# EAGLE design tm5 (EAGLE 9.6.1)
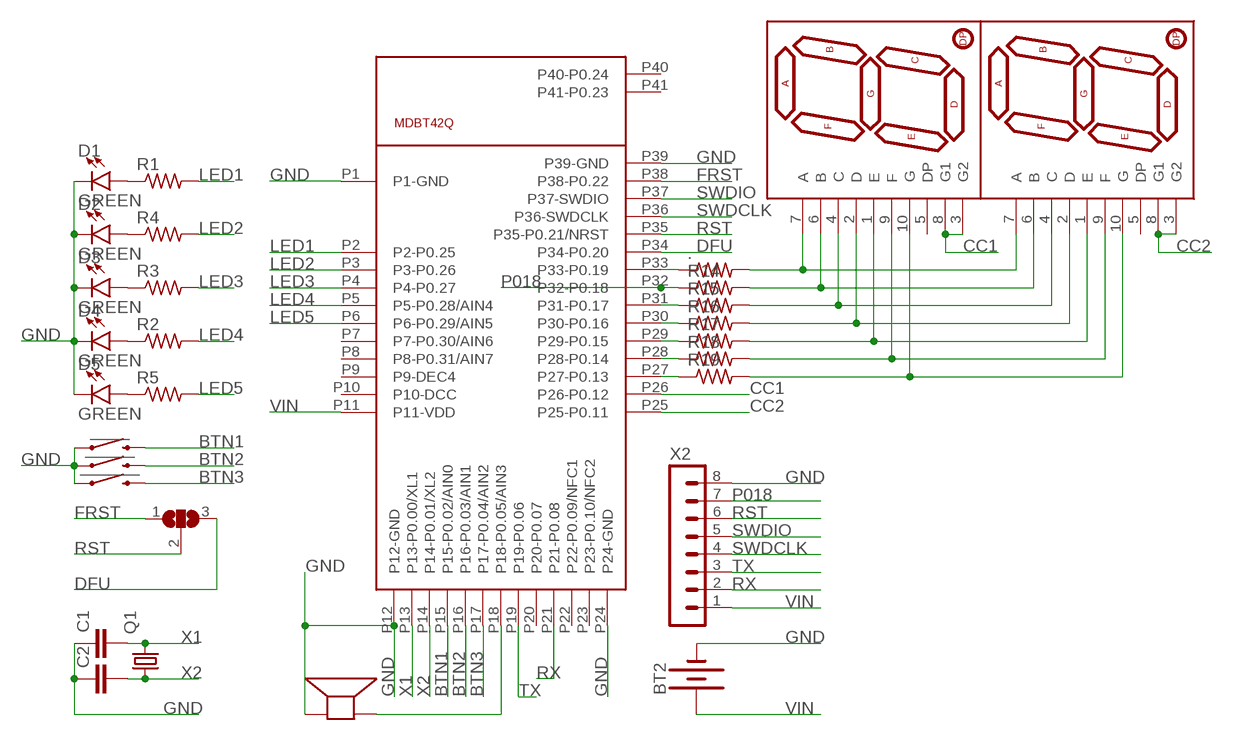
[diagram p0: schematic, sheet 1]

## Parts
.  R-US_R0603  [R0603]
____  MOMENTARY-SWITCH-SPST-SMD-6.2MM-TALL  [TACTILE_SWITCH_SMD_6.2MM_TALL]
_____  MOMENTARY-SWITCH-SPST-SMD-6.2MM-TALL  [TACTILE_SWITCH_SMD_6.2MM_TALL]
______  MOMENTARY-SWITCH-SPST-SMD-6.2MM-TALL  [TACTILE_SWITCH_SMD_6.2MM_TALL]
BT2  BATTERY-20MM_SMD_4LEGS_OVERPASTE  [BATTCON_20MM_4LEGS_OVERPASTE]
C1  C-EUC0603  [C0603]
C2  C-EUC0603  [C0603]
CFG  SJ2W  [SJ_2]
D1  GREEN  LED-GREEN1206  [LED-1206]
D2  GREEN  LED-GREEN1206  [LED-1206]
D3  GREEN  LED-GREEN1206  [LED-1206]
D4  GREEN  LED-GREEN1206  [LED-1206]
D5  GREEN  LED-GREEN1206  [LED-1206]
Q1  KX-327-NHT  [3.2X1.5]
R1  R-US_R0603  [R0603]
R2  R-US_R0603  [R0603]
R3  R-US_R0603  [R0603]
R4  R-US_R0603  [R0603]
R5  R-US_R0603  [R0603]
R14  R-US_R0603  [R0603]
R15  R-US_R0603  [R0603]
R16  R-US_R0603  [R0603]
R17  R-US_R0603  [R0603]
R18  R-US_R0603  [R0603]
R19  R-US_R0603  [R0603]
SPK1  SMT-0540-S-R  [SMT-0540-S-R]
U$1  MDBT42Q  [MDBT40]
U$2  7-SEGMENT-DISPLAY-1"-RED  [7-SEGMENT-SMD]
U$3  7-SEGMENT-DISPLAY-1"-RED  [7-SEGMENT-SMD]
X2  SM08B-SRSS-TB  [SM08B-SRSS-TB]

## Nets
BTN1: ____.B2 U$1.P15(P15-P0.02/AIN0)
BTN2: _____.B2 U$1.P16(P16-P0.03/AIN1)
BTN3: ______.B2 U$1.P17(P17-P0.04/AIN2)
CC1: U$1.P26(P26-P0.12) U$2.3(G2) U$2.8(G1)
CC2: U$1.P25(P25-P0.11) U$3.3(G2) U$3.8(G1)
DFU: CFG.3 U$1.P34(P34-P0.20)
FRST: CFG.1 U$1.P38(P38-P0.22)
GND: ____.A2 _____.A2 ______.A2 BT2.2(-) C1.1 C2.1 D1.C D2.C D3.C D4.C D5.C SPK1.-(+) U$1.P1(P1-GND) U$1.P12(P12-GND) U$1.P24(P24-GND) U$1.P39(P39-GND) X2.8
LED1: R1.2 U$1.P2(P2-P0.25)
LED2: R4.2 U$1.P3(P3-P0.26)
LED3: R3.2 U$1.P4(P4-P0.27)
LED4: R2.2 U$1.P5(P5-P0.28/AIN4)
LED5: R5.2 U$1.P6(P6-P0.29/AIN5)
N$1: ..1 U$1.P33(P33-P0.19)
N$3: R15.1 U$1.P31(P31-P0.17)
N$4: D1.A R1.1
N$5: D2.A R4.1
N$6: D3.A R3.1
N$7: D4.A R2.1
N$8: R16.1 U$1.P30(P30-P0.16)
N$9: R17.1 U$1.P29(P29-P0.15)
N$10: R18.1 U$1.P28(P28-P0.14)
N$11: R19.1 U$1.P27(P27-P0.13)
N$12: ..2 U$2.7(A) U$3.7(A)
N$13: SPK1.+(-) U$1.P18(P18-P0.05/AIN3)
N$14: R14.2 U$2.6(B) U$3.6(B)
N$15: R15.2 U$2.4(C) U$3.4(C)
N$16: D5.A R5.1
N$17: R16.2 U$2.2(D) U$3.2(D)
N$18: R17.2 U$2.1(E) U$3.1(E)
N$19: R18.2 U$2.9(F) U$3.9(F)
N$20: R19.2 U$2.10(G) U$3.10(G)
P018: R14.1 U$1.P32(P32-P0.18) X2.7
RST: CFG.2 U$1.P35(P35-P0.21/NRST) X2.6
RX: U$1.P21(P21-P0.08) X2.2
SWDCLK: U$1.P36(P36-SWDCLK) X2.4
SWDIO: U$1.P37(P37-SWDIO) X2.5
TX: U$1.P19(P19-P0.06) X2.3
VIN: BT2.1(+) U$1.P11(P11-VDD) X2.1
X1: C1.2 Q1.2 U$1.P13(P13-P0.00/XL1)
X2: C2.2 Q1.1 U$1.P14(P14-P0.01/XL2)
Unconnected: U$1.P7(P7-P0.30/AIN6) U$1.P8(P8-P0.31/AIN7) U$1.P9(P9-DEC4) U$1.P10(P10-DCC) U$1.P20(P20-P0.07) U$1.P22(P22-P0.09/NFC1) U$1.P23(P23-P0.10/NFC2) U$1.P40(P40-P0.24) U$1.P41(P41-P0.23) U$2.5(DP) U$3.5(DP)

## Library data of the parts
. R1-R5 R14-R19 = adafruit:R-US_: RESISTOR, American symbol
____ _____ ______ = Sparkfun-switches:MOMENTARY-SWITCH-SPST: Momentary Switch (Pushbutton) - SPST Normally-open (NO) SPST momentary switches (buttons, pushbuttons). Variants PTH-12MM - 12mm square, through-hole Momentary Pushbutton Switch - 12mm Square <https://www.sparkfun.com/products/9190> (COM-09190) PTH-6.0MM, PTH-6.0MM-KIT - 6.0mm square, through-hole Mini Pushbutton Switch <https://www.sparkfun.com/products/97> (COM-00097) KIT package intended for soldering kit's - only one side of pads' copper is exposed. PTH-RIGHT-ANGLE-KIT - Right-angle, through-hole Right Angle Tactile Button <https://www.sparkfun.com/products/10791> - Used on SparkFun BigTime Watch Kit <https://www.sparkfun.com/products/11734> SMD-12MM - 12mm square, surface-mount Tactile Button - SMD (12mm) <https://www.sparkfun.com/products/12993> (COM-12993) Used on SparkFun PicoBoard <https://www.sparkfun.com/products/11888> SMD-4.5MM - 4.5mm Square Trackball Switch Used on SparkFun Blackberry Trackballer Breakout <https://www.sparkfun.com/products/13169> SMD-4.6MMX2.8MM - 4.60mm x 2.80mm, surface mount Used on SparkFun SAMD21 Mini Breakout <https://www.sparkfun.com/products/13664> SMD-5.2MM, SMD-5.2-REDUNDANT - 5.2mm square, surface-mount Mini Pushbutton Switch - SMD <https://www.sparkfun.com/products/8720> (COM-08720) Used on Arduino Pro Mini <https://www.sparkfun.com/products/11114> REDUNDANT package connects both switch circuits together SMD-6.0X3.5MM - 6.0 x 3.5mm, surface mount Momentary Reset Switch SMD <https://www.sparkfun.com/products/8229> (COM-08229) SMD-6.2MM-TALL - 6.2mm square, surface mount Tactile Button - SMD (6mm) <https://www.sparkfun.com/products/12992> Used on SparkFun Digital Sandbox <https://www.sparkfun.com/products/12651> SMD-RIGHT-ANGLE - Right-angle, surface mount Used on SparkFun Block for Intel® Edison - Arduino <https://www.sparkfun.com/products/13036>; PROD_ID: SWCH-11966; SF_SKU: COM-12992
BT2 = SparkFun-Batteries:BATTERY: Battery - Single Cell A variety of battery chemistries, sizes, and footprints. Device List: 20MM_PTH - Coin Cell Battery Holder - 20mm (PTH) <https://www.sparkfun.com/products/783> 20MM_PTH_KIT- Coin Cell battery Holder - 20 mm (PTH) <http://www.sparkfun.com/products/783>kit version with special mask 6.8MM_PTH - Coin Cell Battery Holder - 6.8MM(SMD) <https://www.digikey.com/product-detail/en/seiko-instruments/MS621FE-FL11E/728-1057-ND/1889208?WT.srch=1&gclid=CNOQ5a6LzdQCFZS2wAodXCkE0g> 12MM_SMD - Coin Cell Battery Holder - 12mm (SMD) <https://www.sparkfun.com/products/10592> 12MM_PTH - Coin Cell Battery Holder - 12mm (PTH) <https://www.sparkfun.com/products/7948> 20MM_SMD - 20mm Coin Cell Battery Holder (SMD) (2 legs) Used on the Big Time Watch Kit <https://www.sparkfun.com/products/11734> 20MM_SMD_4LEGS - Coin Cell Battery Holder - 20mm (SMD) <https://www.sparkfun.com/products/11892> 20MM_SMD_4LEGS_OVERPASTE - Coin Cell Battery Holder - 20mm (SMD) <https://www.sparkfun.com/products/11892> (Over-paste on the legs) 24.5MM_PTH - Coin Cell Battery Holder - 24.5mm (PTH) <https://www.sparkfun.com/products/8863> 9V - 9V Battery Holder - PC Mount Used on the SparkFun SparkPunk Sound Kit <https://www.sparkfun.com/products/11177> and SparkFun SparkPunk Sequencer Kit <https://www.sparkfun.com/products/12707> 18650 - Battery Holder - 18650 (PTH) <https://www.sparkfun.com/products/13113> AA - Battery Holder - 1xAA (PTH) <https://www.sparkfun.com/products/7949> AAA - Battery Holder - 1xAAA (PTH) <https://www.sparkfun.com/products/12718> AA_KIT - Battery Holder - 1xAA (PTH) <https://www.sparkfun.com/products/7949> Special kit package - pads only have exposed copper on one side of the board. AAA_KIT - Battery Holder - 1xAAA (PTH) <https://www.sparkfun.com/products/12718> Special kit package - pads only have exposed copper on one side of the board.; PROD_ID: PRT-11892; SF_SKU: BATT-10373
C1 C2 = rcl:C-EU: CAPACITOR, European symbol; SPICEPREFIX: C
CFG = jumper:SJ2W: SMD solder JUMPER
D1-D5 = Sparkfun-LED:LED-GREEN: Green SMD LED Used in manufacturing of various products at SparkFun Packages: 0603 - SMD 0603 package [Product Link] <http://www.futureelectronics.com/en/technologies/semiconductors/optoelectronics/leds/Pages/9894312-LTST-C190GKT.aspx?CrossPart=HSMG-C190&IM=0> LilyPad 1206 - SMD1206 LilyPad package [Product Link] <http://www.futureelectronics.com/en/Technologies/Product.aspx?ProductID=IN150NGHARVATEKCORPORATION2049943&IM=0> 1206 - SMD1206 package [Product Link] <http://www.futureelectronics.com/en/technologies/semiconductors/optoelectronics/leds/Pages/8315665-LTST-C150KGKT.aspx?IM=0> 1206 Bottom Mount -SMD 1206 Bottom Mount [Product Link] <http://www.digikey.com/product-detail/en/lite-on-inc/LTST-C230KGKT/160-1456-1-ND/386854> SparkFun Products: Pro Mini 328 -5V <https://www.sparkfun.com/products/821> RedBoard <https://www.sparkfun.com/products/12757> MP3 Trigger <https://www.sparkfun.com/products/13720> Makey Makey <https://www.sparkfun.com/products/11076>; PROD_ID: DIO-00862
Q1 = crystal-geyer_V1_0:KX-327: Tuning Fork Crystals (kHz) SMD: KX327 - Serie Model Size l/w/h [mm] Frequency Range Frequency Stability Temp. Range [°C] Load Capacitance AECQ 200 availabel Datasheet KX-327VT KX-327FT KX-327RT KX-327NHT KX-327NHF KX-327L KX-327S 1.25/1.05/0.5 1.6/1.0/0.5 2.0/1.2/0.6 3.2/1.5/0.8 3.2/1.5/0.8 7.0/1.5/1.4 8.2/3.8/2.5 32,768 kHz 32,768 kHz 32,768 kHz 32,768 kHz 32,768 kHz 32,768 kHz 32,768 kHz ±10 … ±20ppm ±10 … ±20ppm ±10 … ±20ppm ±10 … ±20ppm ±10 … ±20ppm ±10 … ±20ppm ±5 … ±20ppm (*) -40°C …+85°C (*) -40°C …+85°C (*) -40°C …+85°C (*) -40°C …+85°C (*) -40°C …+125°C (*) -40°C …+85°C (*) -40°C …+85°C 7/9/12,5 7/9/12,5 7/9/12,6 7/9/12,5 9/12,5 7/9/12,5 6/12,5 - - - - yes - - KX-327VT.pdf <http://www.geyer-electronic.de/uploads/tx_userartikelfrequenz/GEYER-KX-327VT.pdf> KX-327FT.pdf <http://www.geyer-electronic.de/uploads/tx_userartikelfrequenz/GEYER-KX-327FT.pdf> KX-327RT.pdf <http://www.geyer-electronic.de/uploads/tx_userartikelfrequenz/GEYER-KX-327RT.pdf> KX-327NHT.pdf <http://www.geyer-electronic.de/uploads/tx_userartikelfrequenz/GEYER-KX-327NHT.pdf> KX-327NHF.pdf <http://www.geyer-electronic.de/uploads/tx_userartikelfrequenz/GEYER-KX-327NHF.pdf> KX-327L.pdf <http://www.geyer-electronic.de/uploads/tx_userartikelfrequenz/GEYER-KX-327L.pdf> KX-327S.pdf <http://www.geyer-electronic.de/uploads/tx_userartikelfrequenz/GEYER-KX-327S.pdf> <http://www.geyer-electronic.de/fileadmin/template/img/logo-geyer-electronic.png> Details see: http://www.geyer-electronic.de/Frequenz-Produkte.9.0.html Created 2016-06-07, Hans Locher 2016 (C) Geyer Quartz Technology KX327VT,KX327FT,KX327RT,KX327NHT,KX327NHF,KX327S,KX327L;125105;1610;2012;3215;7015;8238;1,25x1,05,1.25x1.05;1,6x1,0,1.6x1.0;2,0x1,2,2.0x1.2;3,2x1,5,3.2x1.5;8,2x3,8,8.2x3.8,7.0x1.5,7,0x1,532.768kHz
SPK1 = adafruit:SMT-0540-S-R: SMT-0549-S-R Small surface-mount magnetic buzzer
U$1 = mdbt42:MDBT42Q
U$2 U$3 = balto:7-SEGMENT-DISPLAY-1"-RED: 7-Segment Display 1" Red (COM-08546)
X2 = con-JST:SM08B-SRSS: JST SH series header 1.00mm pitch disconnectable crimp style connectors, horizontal (side entry type), 8 pins

## Board
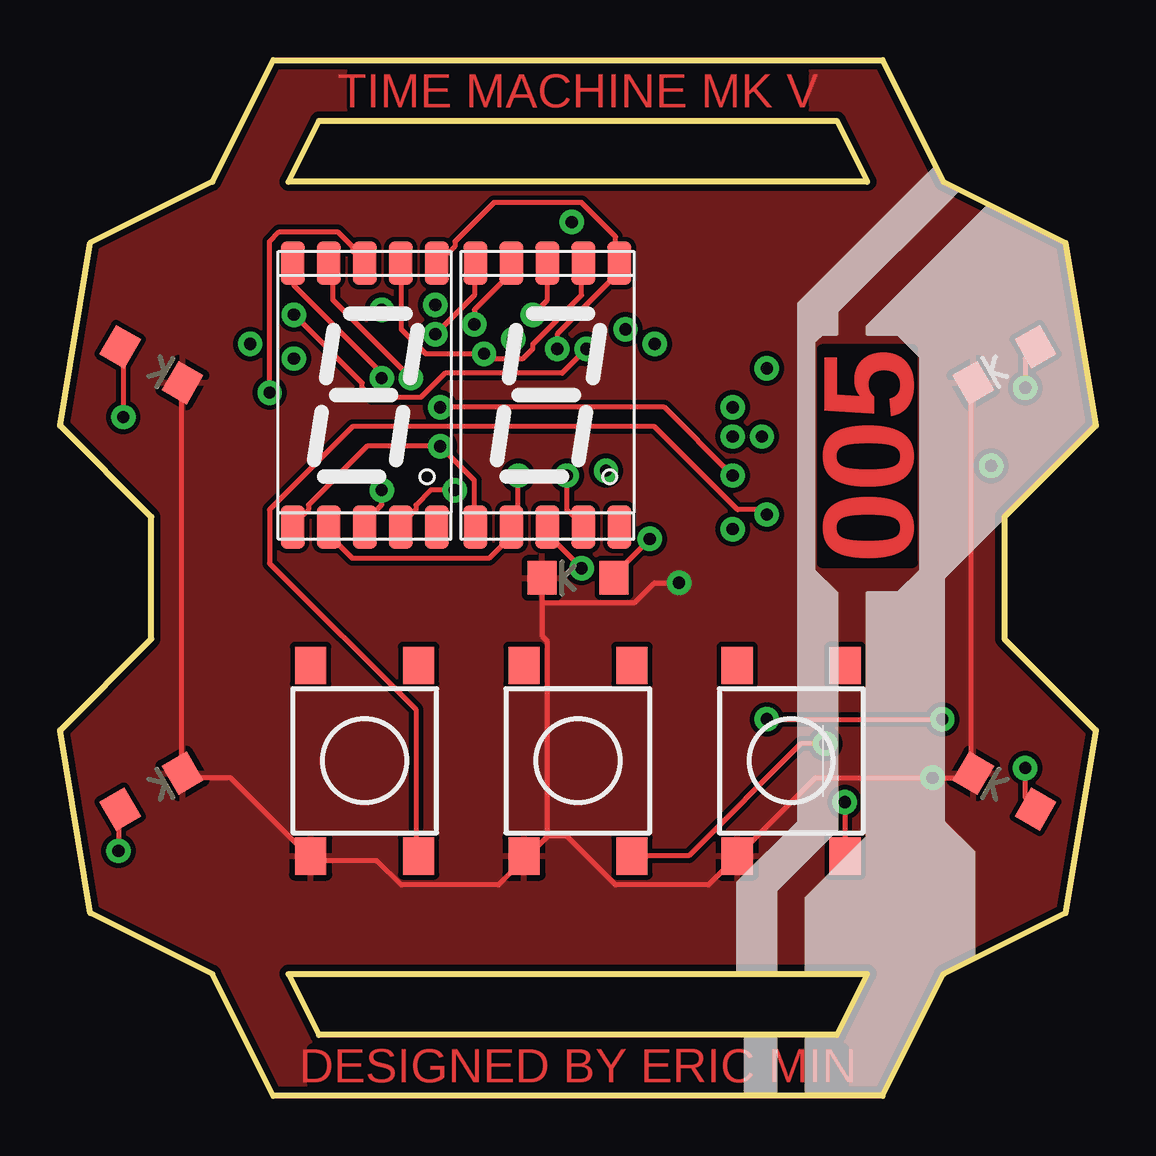
[diagram p1: board, top side]
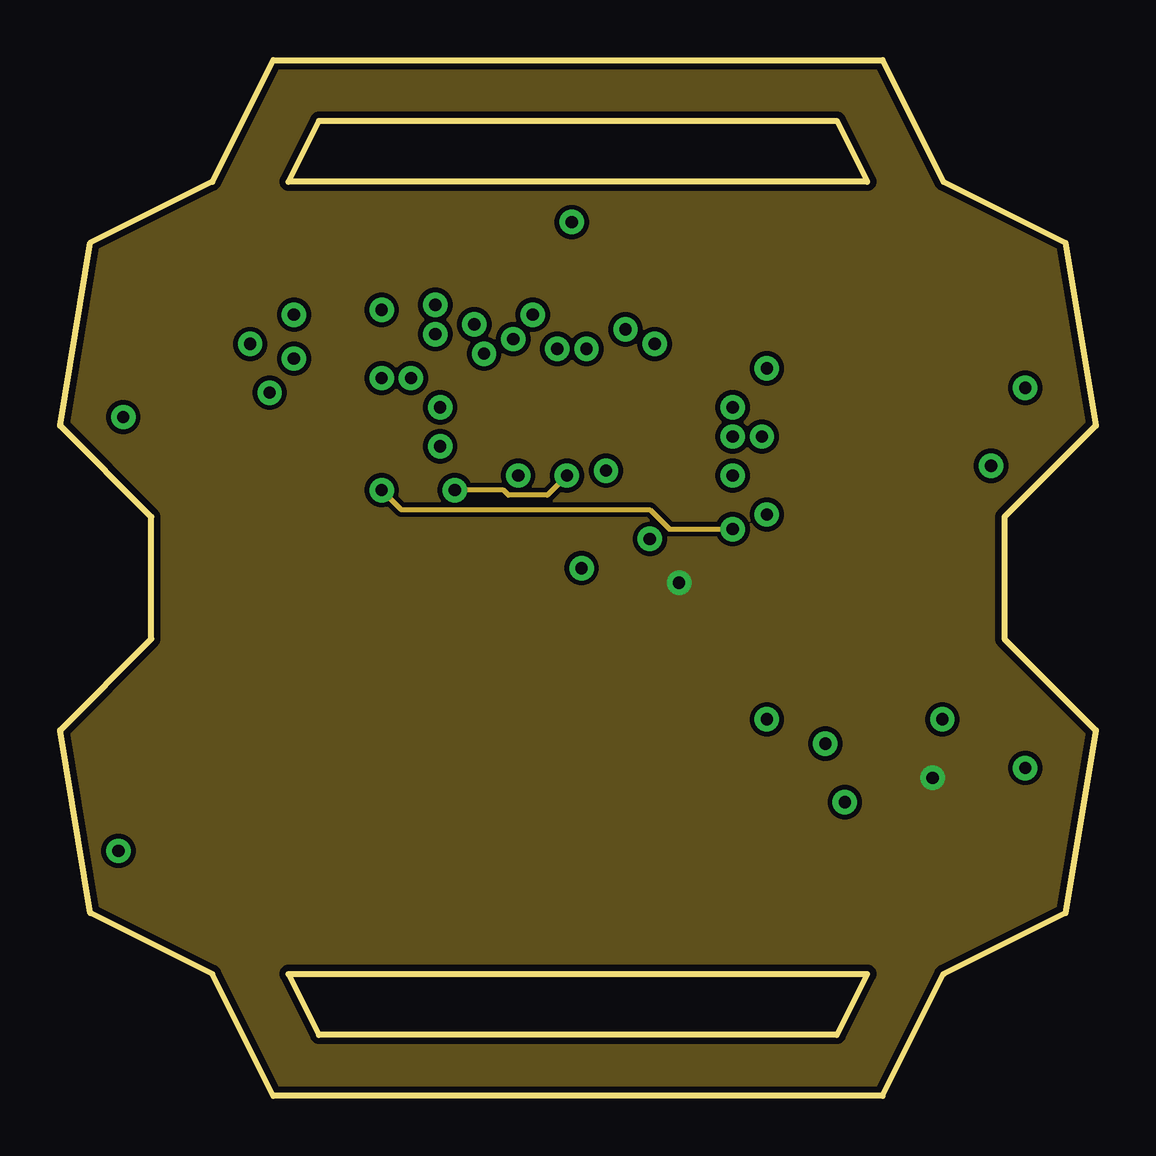
[diagram p2: board, inner layer Route2]
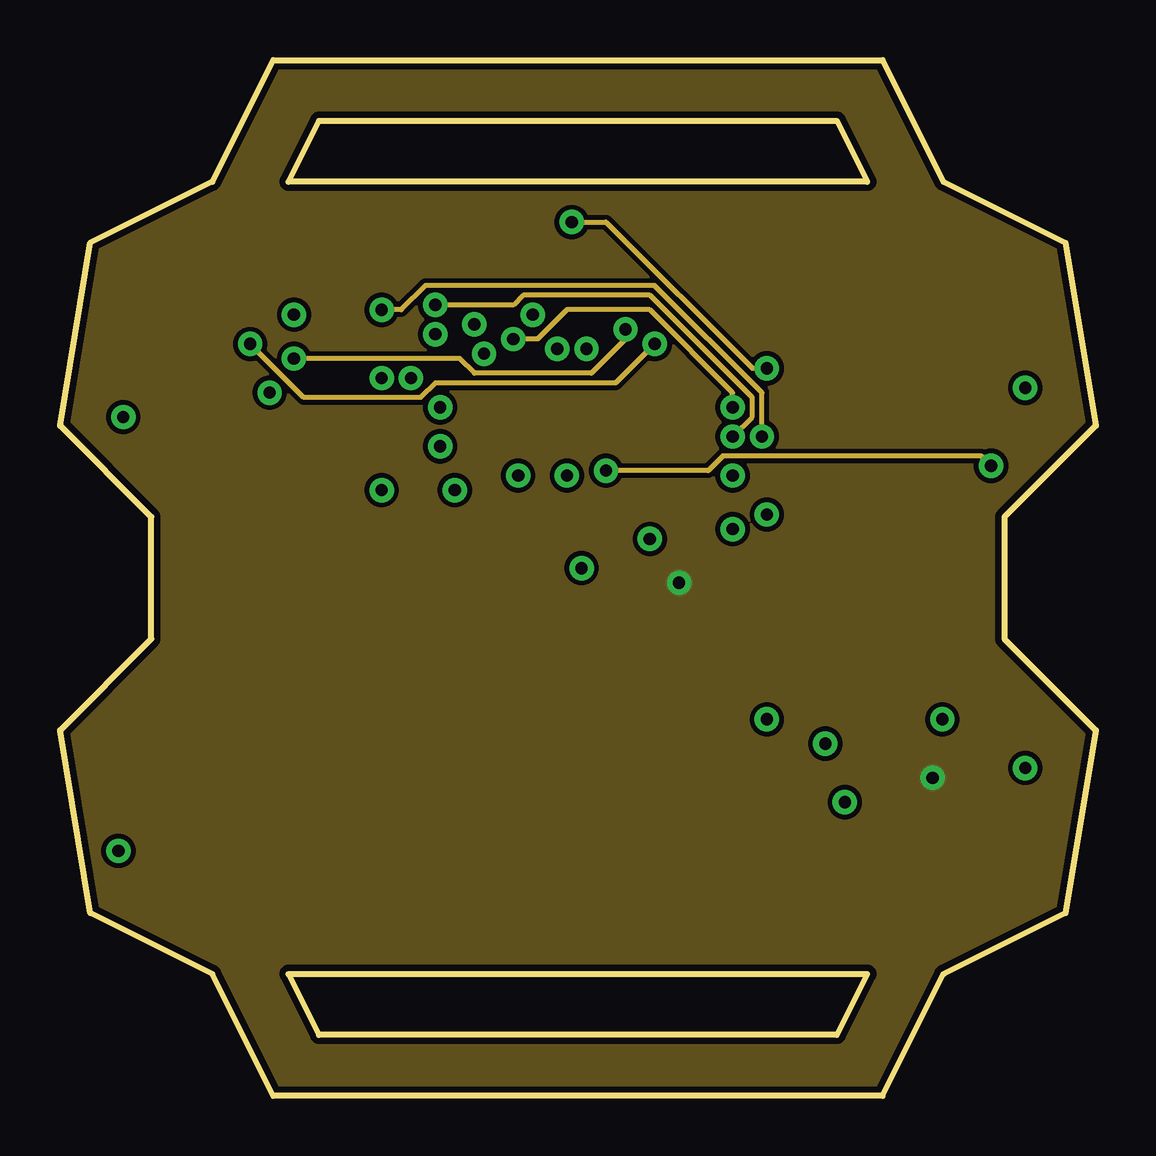
[diagram p3: board, inner layer Route15]
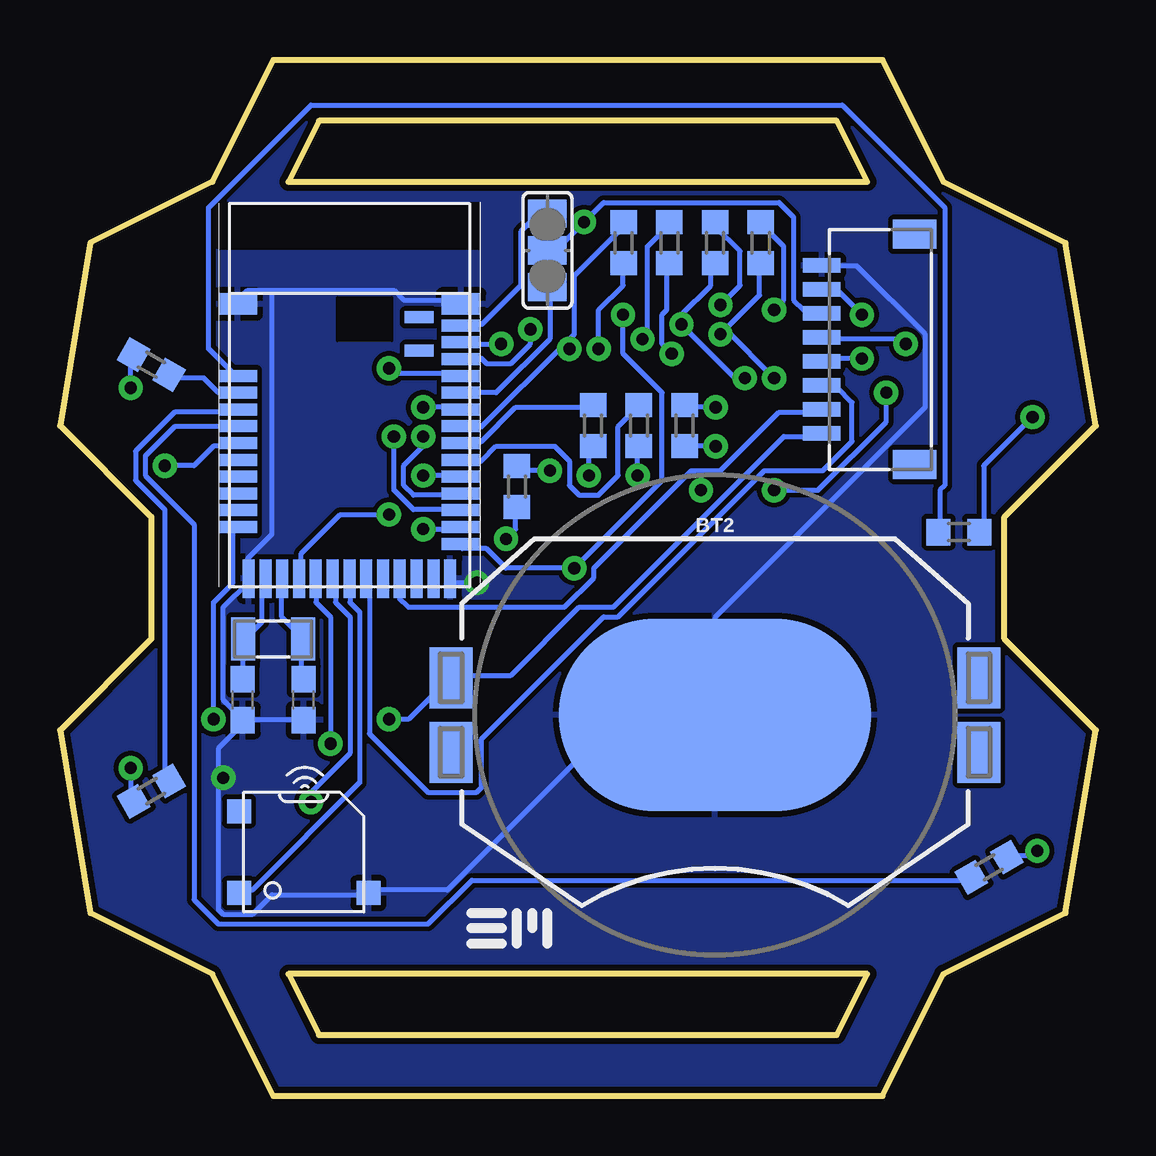
[diagram p4: board, bottom side, seen from below]

Size 43.18 x 43.18 mm. Coordinates in mm from the lower left corner, seen from the top.
Outline: 34.29,0 8.89,0 6.35,5.08 1.27,7.62 0,15.24 3.81,19.05 3.81,24.13 0,27.94 1.27,35.56 6.35,38.1 8.89,43.18 34.29,43.18 36.83,38.1 41.91,35.56 43.18,27.94 39.37,24.13 39.37,19.05 43.18,15.24 41.91,7.62 36.83,5.08 34.29,0
Outline: 9.53,38.1 10.79,40.64 32.39,40.64 33.66,38.1 9.53,38.1
Outline: 33.66,5.08 32.39,2.54 10.79,2.54 9.53,5.08 33.66,5.08
Copper layers (1+2*15+16): Top 0.035mm / dielectric 1.5mm / Route2 0.035mm / dielectric 0.15mm / Route15 0.035mm / dielectric 0.2mm / Bottom 0.035mm
Design rules "SparkFun *": minimum track width 8mil, minimum drill 20mil, track to track 8mil, track to pad 8mil, pad to pad 8mil, via to via 8mil, smd to smd 8mil, copper to edge 10mil, drill to drill 8mil, minimum pad ring 12mil, minimum via ring 10mil, stop-mask expansion 4mil, vias tented up to drill 25mil, thermal gap 10mil

### Footprints (pad centres in the part's own frame; a part is rotated, then mirrored left to right if it is on the bottom)
R0603 = smd 1 x 1.1: 1 -0.85,0; 2 0.85,0
TACTILE_SWITCH_SMD_6.2MM_TALL = smd 1.55 x 1.3: A1 -3.975,-2.25; A2 3.975,-2.25; B1 -3.975,2.25; B2 3.975,2.25
BATTCON_20MM_4LEGS_OVERPASTE = smd 1.778 x 2.54: 1 -11,1.55; 3 11,1.55; P$1 -11,-1.55; P$2 11,-1.55 | smd 13 x 8: 2 0,0
C0603 = smd 1.1 x 1: 1 -0.85,0; 2 0.85,0
SJ_2 = smd 1.168 x 1.6: 1 -1.524,0; 2 0,0; 3 1.524,0
LED-1206 = smd 1.2 x 1.4: A -1.5,0; C 1.5,0
3.2X1.5 = smd 1 x 1.8: 1 -1.25,0; 2 1.25,0
SMT-0540-S-R = smd 1 x 1: + 1.7,-2.7; - 1.7,2.7; M -1.7,-2.7
MDBT40 = smd 1.6 x 0.9: P1 -4.65,3.8; P39 4.65,3.8 | smd 1.6 x 0.5: P2 -4.65,0.8; P3 -4.65,0.1; P4 -4.65,-0.6; P5 -4.65,-1.3; P6 -4.65,-2; P7 -4.65,-2.7; P8 -4.65,-3.4; P9 -4.65,-4.1; P10 -4.65,-4.8; P11 -4.65,-5.5; P25 4.65,-6.2; P26 4.65,-5.5; P27 4.65,-4.8; P28 4.65,-4.1; P29 4.65,-3.4; P30 4.65,-2.7; P31 4.65,-2; P32 4.65,-1.3; P33 4.65,-0.6; P34 4.65,0.1; P35 4.65,0.8; P36 4.65,1.5; P37 4.65,2.2; P38 4.65,2.9 | smd 0.5 x 1.6: P12 -4.2,-7.65; P13 -3.5,-7.65; P14 -2.8,-7.65; P15 -2.1,-7.65; P16 -1.4,-7.65; P17 -0.7,-7.65; P18 0,-7.65; P19 0.7,-7.65; P20 1.4,-7.65; P21 2.1,-7.65; P22 2.8,-7.65; P23 3.5,-7.65; P24 4.2,-7.65 | smd 1.2 x 0.5: P40 2.9,3.25; P41 2.9,1.85
7-SEGMENT-SMD = smd 1 x 1.8: 1 -3,-5.5; 2 -1.5,-5.5; 3 0,-5.5; 4 1.5,-5.5; 5 3,-5.5; 6 3,5.5; 7 1.5,5.5; 8 0,5.5; 9 -1.5,5.5; 10 -3,5.5
SM08B-SRSS-TB = smd 0.6 x 1.55: 1 3.5,0; 2 2.5,0; 3 1.5,0; 4 0.5,0; 5 -0.5,0; 6 -1.5,0; 7 -2.5,0; 8 -3.5,0 | smd 1.2 x 1.8: M1 4.8,3.875; M2 -4.8,3.875

### Placement (x,y rotation side)
.  17.78,35.56 270 bottom
____  12.7,13.97 270 top
_____  21.59,13.97 270 top
______  30.48,13.97 270 top
BT2  15.87,15.87 0 bottom
C1  35.56,16.51 90 bottom
C2  33.02,16.51 90 bottom
CFG  22.86,35.24 270 bottom
D1  3.81,30.48 330 top
D2  39.37,30.48 210 top
D3  39.37,12.7 150 top
D4  3.81,12.7 30 top
D5  21.59,21.59 180 top
Q1  34.29,19.05 180 bottom
R1  5.71,23.5 180 bottom
R2  4.45,9.53 210 bottom
R3  39.37,12.7 30 bottom
R4  39.37,30.48 330 bottom
R5  24.13,25.4 90 bottom
R14  19.69,35.56 270 bottom
R15  20.95,27.94 270 bottom
R16  19.05,27.94 270 bottom
R17  17.15,27.94 270 bottom
R18  15.87,35.56 270 bottom
R19  13.97,35.56 270 bottom
SPK1  33.02,10.16 270 bottom
U$1  31.12,29.21 0 bottom
U$2  12.7,29.21 0 top
U$3  20.32,29.21 0 top
X2  11.43,31.12 270 bottom

### Tracks (layer width: path | path; a pad name or v marks a point on that pad's centre or on a via)
BTN1  (via drill 0.51)
  Top 0.203: v29.46,24.23 29.26,24.44 28.25,24.44 24.79,27.89 12.19,27.89 8.74,24.44 8.74,22.2 14.83,16.1 14.83,10.01 ____.B2
  Bottom 0.203: v29.46,24.23 31.5,24.23 33.12,22.61 33.12,21.59 U$1.P15
BTN2  (via drill 0.51)
  Top 0.203: v31.9,14.68 30.89,14.68 26.21,10.01 23.98,10.01 _____.B2
  Bottom 0.203: v31.9,14.68 31.9,19.96 32.51,20.57 32.51,21.39 U$1.P16
BTN3  (via drill 0.51)
  Top 0.203: v32.72,12.24 32.72,10.01 ______.B2
  Bottom 0.203: v32.72,12.24 32.72,12.65 31.09,14.28 31.09,19.96 31.7,20.57 31.7,21.39 U$1.P17
CC1  (via drill 0.51)
  Top 0.203: v13.41,25.25 13.41,24.64 12.6,23.83 U$2.3 | v8.74,29.31 8.74,35.61 9.14,36.02 11.58,36.02 12.19,35.41 12.19,35.2 12.6,34.8 U$2.8
  Route2 0.203: v28.04,23.62 25.4,23.62 24.59,24.44 14.22,24.44 v13.41,25.25
  Bottom 0.203: v28.04,23.62 26.62,23.62 U$1.P26 | v8.74,29.31 8.74,28.09 11.58,25.25 v13.41,25.25
CC2  (via drill 0.51)
  Top 0.203: v21.74,22 20.32,23.42 U$3.3 | U$3.8 20.32,33.17 v19.71,32.56
  Bottom 0.203: U$1.P25 26.42,22.81 25.4,22.81 24.59,22 v21.74,22 18.09,25.65 18.09,29.31 19.71,30.94 v19.71,32.56
DFU
  Bottom 0.203: U$1.P34 26.42,29.31 24.99,29.31 22.76,31.55 22.76,33.58 CFG.3
FRST
  Bottom 0.203: U$1.P38 26.42,32.16 25.6,32.16 23.98,33.78 23.98,36.02 23.37,36.63 22.96,36.63 CFG.1
GND  (via drill 0.51)
  Top 0.203: D1.C 5.08,29.72 5.08,13.46 D4.C 5.28,13.26 7.11,13.26 10.36,10.01 ____.A2 10.57,9.8 13.21,9.8 14.22,8.79 18.29,8.79 19.3,9.8 _____.A2 19.51,10.01 20.32,10.82 | 20.12,20.57 20.12,19.15 20.32,18.95 20.32,10.82 | 20.12,20.57 20.12,21.59 D5.C | v25.81,21.39 24.79,21.39 23.98,20.57 20.12,20.57 | D2.C 38,29.72 38,13.46 D3.C 38,13.26 v36.37,13.26 31.5,13.26 28.25,10.01 ______.A2 28.04,9.8 27.03,8.79 23.16,8.79 21.13,10.82 20.32,10.82
  Bottom 0.203: v25.81,21.39 26.82,21.39 U$1.P24 | 34.34,33.58 35.36,33.58 35.76,33.17 U$1.P1 | 34.34,33.58 29.26,33.58 28.85,33.17 26.62,33.17 U$1.P39 | 36.58,13.26 36.58,14.48 35.56,15.49 C1.1 35.56,15.7 | 36.58,13.26 36.58,7.77 36.37,7.57 35.15,7.57 34.34,8.38 30.48,8.38 SPK1.- 30.28,8.58 27.03,8.58 19.91,15.7 16.05,15.7 BT2.2 15.85,15.9 15.85,19.96 7.11,28.7 7.11,31.75 9.96,34.59 11.38,34.59 X2.8 | 35.56,15.7 33.12,15.7 C2.1 | 35.56,15.7 36.37,16.51 36.37,20.37 35.36,21.39 U$1.P12 35.36,21.59 35.36,22.4 34.34,23.42 34.34,33.58 | 36.58,13.26 v36.37,13.26
  pour Bottom: -5.08,48.26 48.26,48.26 48.26,-5.08 -5.08,-5.08
  pour Route15: -3.81,46.99 46.99,46.99 46.99,-3.81 -3.81,-3.81
  pour Route2: -2.54,45.72 45.72,45.72 45.72,-2.54 -2.54,-2.54
  pour Top: -1.27,44.45 44.45,44.45 44.45,-1.27 -1.27,-1.27
LED1
  Bottom 0.203: R1.2 6.5,23.62 6.5,25.25 6.3,25.45 6.3,37.03 10.57,41.3 32.72,41.3 36.98,37.03 36.98,31.14 35.97,30.12 U$1.P2
LED2
  Bottom 0.203: R4.2 38.61,29.92 37.19,29.92 36.58,29.31 35.97,29.31 U$1.P3
LED3
  Bottom 0.203: R3.2 38.81,13.26 38.81,24.44 40.03,25.65 40.03,26.87 38.41,28.5 35.97,28.5 U$1.P4
LED4
  Bottom 0.203: R2.2 5.28,8.99 26.01,8.99 27.84,7.16 36.58,7.16 37.59,8.18 37.59,23.83 39.62,25.86 39.62,26.67 38.41,27.89 35.97,27.89 U$1.P5
LED5  (via drill 0.51)
  Route15 0.203: v22.76,26.06 27.03,26.06 27.64,26.67 38.41,26.67 v38.81,26.26
  Bottom 0.203: v22.76,26.06 23.98,26.06 R5.2 | v38.81,26.26 37.59,26.26 36.78,27.08 35.97,27.08 U$1.P6
N$1  (via drill 0.51)
  Route15 0.203: v18.9,31.55 19.91,31.55 21.13,32.77 24.59,32.77 28.04,29.31 v28.04,28.7
  Bottom 0.203: v18.9,31.55 18.69,31.75 18.69,35.41 17.88,36.22 ..1 | v28.04,28.7 26.62,28.7 U$1.P33
N$3
  Bottom 0.203: R15.1 21.13,28.7 24.18,28.7 25.6,27.28 26.42,27.28 U$1.P31
N$4  (via drill 0.51)
  Top 0.203: v2.64,28.3 2.64,31.14 D1.A
  Bottom 0.203: v2.64,28.3 4.67,26.26 4.67,23.62 R1.1
N$5  (via drill 0.51)
  Top 0.203: v40.23,29.52 40.23,30.73 40.64,31.14 D2.A
  Bottom 0.203: v40.23,29.52 40.23,30.73 R4.1
N$6  (via drill 0.51)
  Top 0.203: v40.23,13.67 40.23,12.45 40.64,12.04 D3.A
  Bottom 0.203: v40.23,13.67 40.23,12.45 R3.1
N$7  (via drill 0.51)
  Top 0.203: v2.44,10.21 2.44,11.84 D4.A
  Bottom 0.203: v2.44,10.21 2.64,10.01 3.66,10.01 R2.1
N$8
  Bottom 0.203: R16.1 19.1,28.7 19.91,27.89 19.91,25.86 20.73,25.04 21.54,25.04 21.95,25.45 21.95,26.47 22.55,27.08 24.99,27.08 25.6,26.47 26.42,26.47 U$1.P30
N$9  (via drill 0.51)
  Top 0.203: v15.85,28.7 25.2,28.7 v28.04,25.86
  Bottom 0.203: v15.85,28.7 17.07,28.7 R17.1 | v28.04,25.86 26.62,25.86 U$1.P29
N$10  (via drill 0.51)
  Route15 0.203: v15.65,32.97 18.9,32.97 19.3,33.38 24.59,33.38 28.85,29.11 28.85,28.3 v28.04,27.48
  Bottom 0.203: v15.65,32.97 14.83,33.78 14.83,35.2 15.85,36.22 R18.1 | v28.04,27.48 28.04,27.08 28.85,26.26 28.85,25.45 28.45,25.04 26.62,25.04 U$1.P28
N$11  (via drill 0.51)
  Route15 0.203: v13.41,32.77 14.22,32.77 15.24,33.78 24.79,33.78 29.26,29.31 v29.26,27.48
  Bottom 0.203: v13.41,32.77 13.01,33.17 13.01,35.41 13.82,36.22 R19.1 | v29.26,27.48 29.26,25.25 28.45,24.44 26.62,24.44 U$1.P27
N$12  (via drill 0.51)
  Top 0.203: U$2.7 14.22,34.59 14.22,31.95 15.24,30.94 v17.68,30.94 17.88,30.73 19.3,30.73 19.71,31.14 19.71,31.34 21.74,33.38 21.74,34.59 U$3.7
  Bottom 0.203: v17.68,30.94 18.09,31.34 18.09,32.56 17.88,32.77 17.88,34.59 ..2
N$13
  Bottom 0.203: SPK1.+ 35.56,8.58 35.15,8.58 30.68,13.06 30.68,20.17 31.09,20.57 31.09,21.39 U$1.P18
N$14  (via drill 0.51)
  Top 0.203: v20.73,31.14 20.73,31.75 23.16,34.19 23.16,34.59 U$3.6 23.16,34.8 23.16,35.81 21.74,37.24 18.09,37.24 16.46,35.61 16.46,35.41 15.85,34.8 U$2.6
  Bottom 0.203: v20.73,31.14 20.73,32.77 19.71,33.78 19.71,34.59 R14.2
N$15  (via drill 0.51)
  Top 0.203: v21.13,25.86 21.13,24.44 21.74,23.83 U$3.4 | v16.46,25.25 15.44,25.25 14.83,24.64 14.83,24.44 14.22,23.83 U$2.4
  Route2 0.203: v16.46,25.25 18.49,25.25 18.69,25.04 20.32,25.04 v21.13,25.86
  Bottom 0.203: v21.13,25.86 21.13,27.08 R15.2
N$16  (via drill 0.51)
  Top 0.203: v24.59,23.22 22.96,21.59 D5.A
  Bottom 0.203: v24.59,23.22 24.18,23.62 24.18,24.44 R5.1
N$17  (via drill 0.51)
  Top 0.203: v19.1,25.86 19.1,24.03 18.9,23.83 U$3.2 18.69,23.62 18.69,23.22 17.88,22.4 12.19,22.4 11.38,23.22 11.38,23.62 U$2.2
  Bottom 0.203: v19.1,25.86 19.1,27.08 R16.2
N$18  (via drill 0.51)
  Top 0.203: U$3.1 17.27,23.83 17.27,25.65 v15.85,27.08 12.8,27.08 10.36,24.64 10.36,24.44 9.75,23.83 U$2.1
  Bottom 0.203: v15.85,27.08 17.07,27.08 R17.2
N$19  (via drill 0.51)
  Top 0.203: v17.27,32.16 17.27,32.77 18.69,34.19 18.69,34.59 U$3.9 | v14.63,29.92 11.38,33.17 11.38,34.59 U$2.9
  Bottom 0.203: R18.2 16.05,34.59 16.05,33.78 17.27,32.56 v17.27,32.16 15.04,29.92 v14.63,29.92
N$20  (via drill 0.51)
  Top 0.203: v15.65,31.75 17.27,33.38 17.27,34.59 U$3.10 | v13.41,29.92 13.41,30.12 9.75,33.78 9.75,34.59 U$2.10
  Bottom 0.203: 15.44,31.95 14.02,33.38 14.02,34.59 R19.2 | 15.44,31.95 v13.41,29.92 | 15.44,31.95 v15.65,31.75
P018  (via drill 0.51)
  Top 0.203: v9.75,32.56 12.6,29.72 12.6,29.52 13.01,29.11 15.04,29.11 16.05,30.12 20.93,30.12 v21.95,31.14
  Bottom 0.203: 22.15,31.34 25.6,27.89 26.42,27.89 U$1.P32 | 22.15,31.34 21.74,31.75 21.74,34.19 19.71,36.22 R14.1 | v9.75,32.56 10.77,33.58 11.38,33.58 X2.7 | 22.15,31.34 v21.95,31.14
RST  (via drill 0.51)
  Route15 0.203: v29.46,30.33 28.85,30.33 22.76,36.42 v21.34,36.42
  Bottom 0.203: X2.6 11.58,32.77 12.19,32.77 12.6,33.17 12.6,36.63 13.21,37.24 20.52,37.24 v21.34,36.42 22.35,35.41 22.76,35.41 CFG.2 | v29.46,30.33 29.26,30.12 26.62,30.12 U$1.P35
RX
  Bottom 0.203: X2.2 11.58,28.5 13.21,28.5 15.65,26.06 16.87,26.06 20.93,22 20.93,21.59 22.15,20.37 28.65,20.37 29.06,20.78 29.06,21.39 U$1.P21
SWDCLK  (via drill 0.51)
  Route15 0.203: v9.75,30.73 16.66,30.73 17.27,30.12 22.15,30.12 23.57,31.55 v23.57,31.95
  Bottom 0.203: v9.75,30.73 11.38,30.73 X2.4 | v23.57,31.95 23.57,31.34 24.38,30.53 25.4,30.53 25.6,30.73 26.42,30.73 U$1.P36
SWDIO  (via drill 0.51)
  Route15 0.203: v7.93,31.34 10.16,29.11 15.04,29.11 15.65,29.72 23.16,29.72 v24.79,31.34
  Bottom 0.203: v7.93,31.34 8.13,31.55 11.38,31.55 X2.5 | v24.79,31.34 26.42,31.34 U$1.P37
TX
  Bottom 0.203: X2.3 11.38,29.52 10.77,29.52 10.16,28.91 10.16,27.28 11.38,26.06 13.82,26.06 19.91,19.96 20.52,19.96 25.6,14.88 25.6,12.85 25.81,12.65 27.84,12.65 30.28,15.09 30.28,21.39 U$1.P19
VIN  (via drill 0.51)
  Top 0.203: v29.46,15.7 v36.78,15.7
  Bottom 0.203: X2.1 11.58,27.48 13.01,27.48 20.12,20.37 21.54,20.37 24.38,17.53 26.82,17.53 BT2.1 27.03,17.32 28.65,15.7 v29.46,15.7 | v36.78,15.7 36.78,20.57 35.97,21.39 35.97,23.62 U$1.P11
X1
  Bottom 0.203: C1.2 35.56,18.95 Q1.2 35.36,19.15 34.75,19.76 34.75,21.39 U$1.P13
X2
  Bottom 0.203: C2.2 33.12,17.53 33.12,18.95 Q1.1 33.12,19.15 33.93,19.96 33.93,21.39 U$1.P14

### Text on the board
Top: TIME MACHINE MK V | 005 | DESIGNED BY ERIC MIN
tStop: TIME MACHINE MK V | 005 | DESIGNED BY ERIC MIN